# Altium schematic sheet Transistor_Block.SchDoc
size A4; SheetNumber: 8; SheetTotal: 8
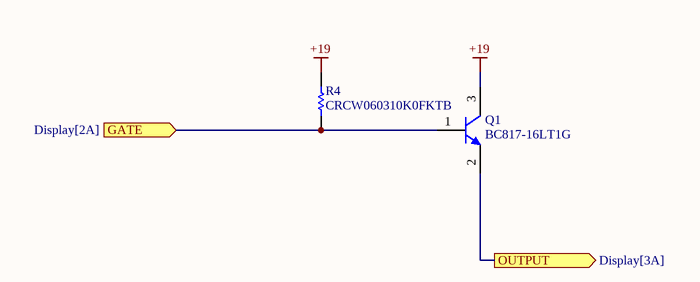
[diagram p0: Transistor_Block.SchDoc]

## Parts
Q1  BC817-16LT1G  [ONSC-SOT-23-3-318-08_V]
R4  CRCW060310K0FKTB  [RESC1609X50X30ML10T20]

## Ports
GATE (in, see Display[2A]), OUTPUT (out, see Display[3A])

## Nets
+19: Q1.3(C) R4.2
GATE: Q1.1(B) R4.1 ; port GATE
OUTPUT: Q1.2(E) ; port OUTPUT

## Library data of the parts
Q1 = CMP-1048-00736-1: General Purpose Transistor, NPN Silicon, 3-Pin SOT-23, Pb-Free, Tape and Reel; Manufacturer: On Semiconductor; IC Continuous (A): 0.5; fT Min (MHz): 100; PartNumber: BC817-16LT1G; Mounting Technology: Surface Mount; PackageVersion: Rev. AP, 11/2009; ComponentLink3Description: Package Specification; PackageReference: SOT-23-3-318-08; Packing: Tape and Reel; ComponentLink1URL: http://www.onsemi.com/; Polarity: NPN; RoHS: TRUE; ComponentLink2URL: http://www.onsemi.com/pub_link/Collateral/BC817-16LT1-D.PDF; ComponentLink3URL: http://www.onsemi.cn/pub_link/Collateral/318-08.PDF; ComponentLink2Description: Datasheet; PackageDescription: 3-Pin Small Outline Transistor, Body 2.92 x 1.3 mm, Pitch 0.95 mm; ComponentLink1Description: Manufacturer URL; DatasheetVersion: Rev. 12
R4 = CMP-2000-03837-1: Manufacturer: Vishay Dale; Part Number: CRCW060310K0FKTB